# EAGLE design fpgadevbrd (EAGLE 5.07)
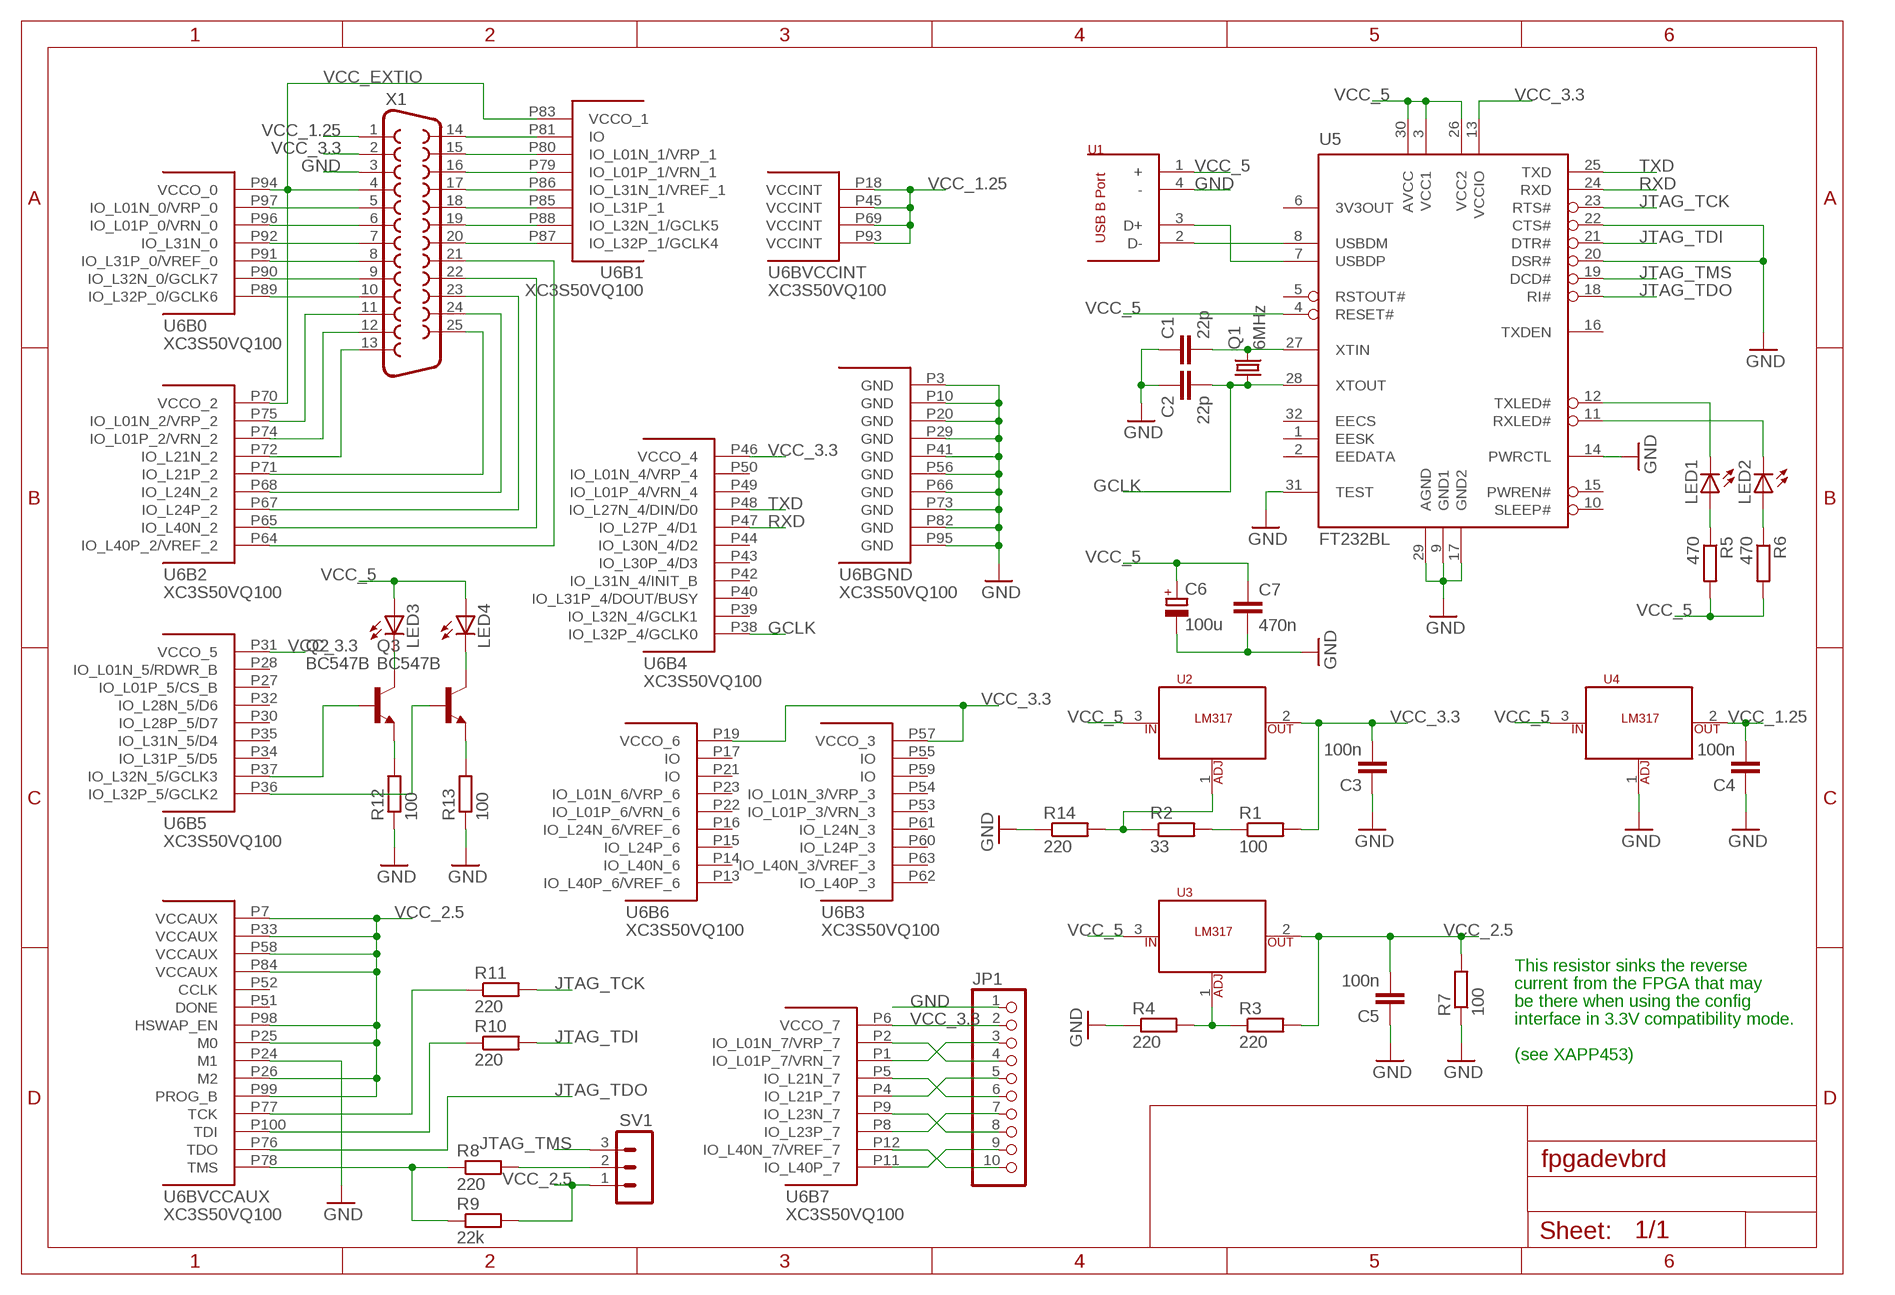
[diagram p0: schematic, sheet 1]

## Parts
C1  22p  C-EU050-025X075  [C050-025X075]
C2  22p  C-EU050-025X075  [C050-025X075]
C3  100n  C-EU050-025X075  [C050-025X075]
C4  100n  C-EU050-025X075  [C050-025X075]
C5  100n  C-EU050-025X075  [C050-025X075]
C6  100u  CPOL-EUTT5D9L  [TT5D9L]
C7  470n  C-EU050-025X075  [C050-025X075]
JP1  PINHD-1X10  [1X10]
LED1  LED5MM  [LED5MM]
LED2  LED5MM  [LED5MM]
LED3  LED5MM  [LED5MM]
LED4  LED5MM  [LED5MM]
Q1  6MHz  CRYSTALHC49U70  [HC49U70]
Q2  BC547B  [TO92]
Q3  BC547B  [TO92]
R1  100  R-EU_0204/7  [0204/7]
R2  33  R-EU_0204/7  [0204/7]
R3  220  R-EU_0204/7  [0204/7]
R4  220  R-EU_0204/7  [0204/7]
R5  470  R-EU_0204/7  [0204/7]
R6  470  R-EU_0204/7  [0204/7]
R7  100  R-EU_0204/7  [0204/7]
R8  220  R-EU_0204/7  [0204/7]
R9  22k  R-EU_0204/7  [0204/7]
R10  220  R-EU_0204/7  [0204/7]
R11  220  R-EU_0204/7  [0204/7]
R12  100  R-EU_0204/7  [0204/7]
R13  100  R-EU_0204/7  [0204/7]
R14  220  R-EU_0204/7  [0204/7]
SV1  MA03-1  [MA03-1]
U1  USB_B  [USB_B]
U2  LM317  [TO220]
U3  LM317  [TO220]
U4  LM317  [TO220]
U5  FT232BL  [LQFP32]
U6  XC3S50VQ100  [VQ100]
X1  F25D  [F25D]

## Nets
GCLK: C2.2 Q1.1 U5.28(XTOUT) U6.P38(B4:IO_L32P_4/GCLK0)
GND [pwr]: C1.1 C2.1 C3.1 C4.1 C5.1 C6.- C7.2 JP1.1 R4.1 R7.1 R12.1 R13.1 R14.1 U1.4(-) U4.1(ADJ) U5.9(GND1) U5.14(PWRCTL) U5.17(GND2) U5.20(DSR#) U5.22(CTS#) U5.29(AGND) U5.31(TEST) U6.P3(BGND:GND) U6.P10(BGND:GND) U6.P20(BGND:GND) U6.P24(BVCCAUX:M1) U6.P29(BGND:GND) U6.P41(BGND:GND) U6.P56(BGND:GND) U6.P66(BGND:GND) U6.P73(BGND:GND) U6.P82(BGND:GND) U6.P95(BGND:GND) X1.3
JTAG_TCK: R11.2 U5.23(RTS#)
JTAG_TDI: R10.2 U5.21(DTR#)
JTAG_TDO: U5.18(RI#) U6.P76(BVCCAUX:TDO)
JTAG_TMS: SV1.3 U5.19(DCD#)
N$1: R8.1 R9.1 U6.P78(BVCCAUX:TMS)
N$2: R1.1 R2.2
N$3: U1.3(D+) U5.7(USBDP)
N$4: R3.1 R4.2 U3.1(ADJ)
N$5: U1.2(D-) U5.8(USBDM)
N$6: C1.2 Q1.2 U5.27(XTIN)
N$7: R2.1 R14.2 U2.1(ADJ)
N$8: LED1.A R5.1
N$9: LED2.A R6.1
N$10: LED1.K(C) U5.12(TXLED#)
N$11: LED2.K(C) U5.11(RXLED#)
N$12: R10.1 U6.P100(BVCCAUX:TDI)
N$13: R11.1 U6.P77(BVCCAUX:TCK)
N$14: R8.2 SV1.2
N$15: U6.P97(B0:IO_L01N_0/VRP_0) X1.5
N$16: U6.P96(B0:IO_L01P_0/VRN_0) X1.6
N$17: U6.P92(B0:IO_L31N_0) X1.7
N$18: U6.P91(B0:IO_L31P_0/VREF_0) X1.8
N$19: U6.P90(B0:IO_L32N_0/GCLK7) X1.9
N$20: U6.P89(B0:IO_L32P_0/GCLK6) X1.10
N$21: U6.P81(B1:IO) X1.14
N$22: U6.P80(B1:IO_L01N_1/VRP_1) X1.15
N$23: U6.P79(B1:IO_L01P_1/VRN_1) X1.16
N$24: U6.P86(B1:IO_L31N_1/VREF_1) X1.17
N$25: U6.P85(B1:IO_L31P_1) X1.18
N$26: U6.P88(B1:IO_L32N_1/GCLK5) X1.19
N$27: U6.P87(B1:IO_L32P_1/GCLK4) X1.20
N$28: U6.P75(B2:IO_L01N_2/VRP_2) X1.11
N$29: U6.P74(B2:IO_L01P_2/VRN_2) X1.12
N$30: U6.P72(B2:IO_L21N_2) X1.13
N$31: U6.P71(B2:IO_L21P_2) X1.25
N$32: U6.P68(B2:IO_L24N_2) X1.24
N$33: U6.P67(B2:IO_L24P_2) X1.23
N$34: U6.P65(B2:IO_L40N_2) X1.22
N$35: U6.P64(B2:IO_L40P_2/VREF_2) X1.21
N$36: JP1.4 U6.P2(B7:IO_L01N_7/VRP_7)
N$37: Q2.1(E) R12.2
N$38: LED4.K(C) Q3.3(C)
N$39: LED3.K(C) Q2.3(C)
N$40: Q3.1(E) R13.2
N$41: Q2.2(B) U6.P37(B5:IO_L32N_5/GCLK3)
N$42: Q3.2(B) U6.P36(B5:IO_L32P_5/GCLK2)
N$43: JP1.3 U6.P1(B7:IO_L01P_7/VRN_7)
N$44: JP1.6 U6.P5(B7:IO_L21N_7)
N$45: JP1.5 U6.P4(B7:IO_L21P_7)
N$46: JP1.8 U6.P9(B7:IO_L23N_7)
N$47: JP1.7 U6.P8(B7:IO_L23P_7)
N$48: JP1.10 U6.P12(B7:IO_L40N_7/VREF_7)
N$49: JP1.9 U6.P11(B7:IO_L40P_7)
RXD: U5.24(RXD) U6.P47(B4:IO_L27P_4/D1)
TXD: U5.25(TXD) U6.P48(B4:IO_L27N_4/DIN/D0)
VCC_1.25 [pwr]: C4.2 U4.2(V_OUT) U6.P18(BVCCINT:VCCINT) U6.P45(BVCCINT:VCCINT) U6.P69(BVCCINT:VCCINT) U6.P93(BVCCINT:VCCINT) X1.1
VCC_2.5 [pwr]: C5.2 R3.2 R7.2 R9.2 SV1.1 U3.2(V_OUT) U6.P7(BVCCAUX:VCCAUX) U6.P25(BVCCAUX:M0) U6.P26(BVCCAUX:M2) U6.P33(BVCCAUX:VCCAUX) U6.P58(BVCCAUX:VCCAUX) U6.P84(BVCCAUX:VCCAUX) U6.P98(BVCCAUX:HSWAP_EN) U6.P99(BVCCAUX:PROG_B)
VCC_3.3 [pwr]: C3.2 JP1.2 R1.2 U2.2(V_OUT) U5.13(VCCIO) U6.P6(B7:VCCO_7) U6.P19(B6:VCCO_6) U6.P31(B5:VCCO_5) U6.P46(B4:VCCO_4) U6.P57(B3:VCCO_3) X1.2
VCC_5 [pwr]: C6.+ C7.1 LED3.A LED4.A R5.2 R6.2 U1.1(+) U2.3(V_IN) U3.3(V_IN) U4.3(V_IN) U5.3(VCC1) U5.4(RESET#) U5.26(VCC2) U5.30(AVCC)
VCC_EXTIO [pwr]: U6.P70(B2:VCCO_2) U6.P83(B1:VCCO_1) U6.P94(B0:VCCO_0) X1.4
Unconnected: U5.1(EESK) U5.2(EEDATA) U5.5(RSTOUT#) U5.6(3V3OUT) U5.10(SLEEP#) U5.15(PWREN#) U5.16(TXDEN) U5.32(EECS) U6.P13(B6:IO_L40P_6/VREF_6) U6.P14(B6:IO_L40N_6) U6.P15(B6:IO_L24P_6) U6.P16(B6:IO_L24N_6/VREF_6) U6.P17(B6:IO) U6.P21(B6:IO) U6.P22(B6:IO_L01P_6/VRN_6) U6.P23(B6:IO_L01N_6/VRP_6) U6.P27(B5:IO_L01P_5/CS_B) U6.P28(B5:IO_L01N_5/RDWR_B) U6.P30(B5:IO_L28P_5/D7) U6.P32(B5:IO_L28N_5/D6) U6.P34(B5:IO_L31P_5/D5) U6.P35(B5:IO_L31N_5/D4) U6.P39(B4:IO_L32N_4/GCLK1) U6.P40(B4:IO_L31P_4/DOUT/BUSY) U6.P42(B4:IO_L31N_4/INIT_B) U6.P43(B4:IO_L30P_4/D3) U6.P44(B4:IO_L30N_4/D2) U6.P49(B4:IO_L01P_4/VRN_4) U6.P50(B4:IO_L01N_4/VRP_4) U6.P51(BVCCAUX:DONE) U6.P52(BVCCAUX:CCLK) U6.P53(B3:IO_L01P_3/VRN_3) U6.P54(B3:IO_L01N_3/VRP_3) U6.P55(B3:IO) U6.P59(B3:IO) U6.P60(B3:IO_L24P_3) U6.P61(B3:IO_L24N_3) U6.P62(B3:IO_L40P_3) U6.P63(B3:IO_L40N_3/VREF_3)

## Notes on the sheet
- This resistor sinks the reverse
- current from the FPGA that may
- be there when using the config
- interface in 3.3V compatibility mode.
- (see XAPP453)

## Library data of the parts
C1-C5 C7 = resistor:C-EU: CAPACITOR, European symbol
C6 = resistor:CPOL-EU: POLARIZED CAPACITOR, European symbol
JP1 = pinhead:PINHD-1X10: PIN HEADER
LED1-LED4 = led:LED: LED OSRAM: - CHIPLED LG R971, LG N971, LY N971, LG Q971, LY Q971, LO R971, LY R971 LH N974, LH R974 LS Q976, LO Q976, LY Q976 LO Q996 - Hyper CHIPLED LW Q18S LB Q993, LB Q99A, LB R99A - SideLED LS A670, LO A670, LY A670, LG A670, LP A670 LB A673, LV A673, LT A673, LW A673 LH A674 LY A675 LS A676, LA A676, LO A676, LY A676, LW A676 LS A679, LY A679, LG A679 - Hyper Micro SIDELED® LS Y876, LA Y876, LO Y876, LY Y876 LT Y87S - SmartLED LW L88C, LW L88S LB L89C, LB L89S, LG L890 LS L89K, LO L89K, LY L89K LS L896, LA L896, LO L896, LY L896 - TOPLED LS T670, LO T670, LY T670, LG T670, LP T670 LSG T670, LSP T670, LSY T670, LOP T670, LYG T670 LG T671, LOG T671, LSG T671 LB T673, LV T673, LT T673, LW T673 LH T674 LS T676, LA T676, LO T676, LY T676, LB T676, LH T676, LSB T676, LW T676 LB T67C, LV T67C, LT T67C, LS T67K, LO T67K, LY T67K, LW E67C LS E67B, LA E67B, LO E67B, LY E67B, LB E67C, LV E67C, LT E67C LW T67C LS T679, LY T679, LG T679 LS T770, LO T770, LY T770, LG T770, LP T770 LB T773, LV T773, LT T773, LW T773 LH T774 LS E675, LA E675, LY E675, LS T675 LS T776, LA T776, LO T776, LY T776, LB T776 LHGB T686 LT T68C, LB T68C - Hyper Mini TOPLED® LB M676 - Mini TOPLED Santana® LG M470 LS M47K, LO M47K, LY M47K Source: http://www.osram.convergy.de LUXEON: - LUMILED® LXK2-PW12-R00, LXK2-PW12-S00, LXK2-PW14-U00, LXK2-PW14-V00 LXK2-PM12-R00, LXK2-PM12-S00, LXK2-PM14-U00 LXK2-PE12-Q00, LXK2-PE12-R00, LXK2-PE12-S00, LXK2-PE14-T00, LXK2-PE14-U00 LXK2-PB12-K00, LXK2-PB12-L00, LXK2-PB12-M00, LXK2-PB14-N00, LXK2-PB14-P00, LXK2-PB14-Q00 LXK2-PR12-L00, LXK2-PR12-M00, LXK2-PR14-Q00, LXK2-PR14-R00 LXK2-PD12-Q00, LXK2-PD12-R00, LXK2-PD12-S00 LXK2-PH12-R00, LXK2-PH12-S00 LXK2-PL12-P00, LXK2-PL12-Q00, LXK2-PL12-R00 Source: www.luxeon.com KINGBRIGHT: KA-3528ASYC Source: www.kingbright.com
Q1 = crystal:CRYSTAL: CRYSTAL
Q2 Q3 = transistor-npn:BC547*: NPN Transistor
R1-R14 = resistor:R-EU_: RESISTOR, European symbol
SV1 = con-lstb:MA03-1: PIN HEADER
U1 = library:USB_B
U2-U4 = library:LM317; TYPE: LM317
U5 = library:FT232BL: USB UART 2nd Generation USB UART (USB <-> Serial) Controller
U6 = library:XC3S50VQ100: Xilinx FPGA: XC3S50VQ100
X1 = con-subd:F25: SUB-D

## Net classes
1 pwr: width 0.762 mm

## Board
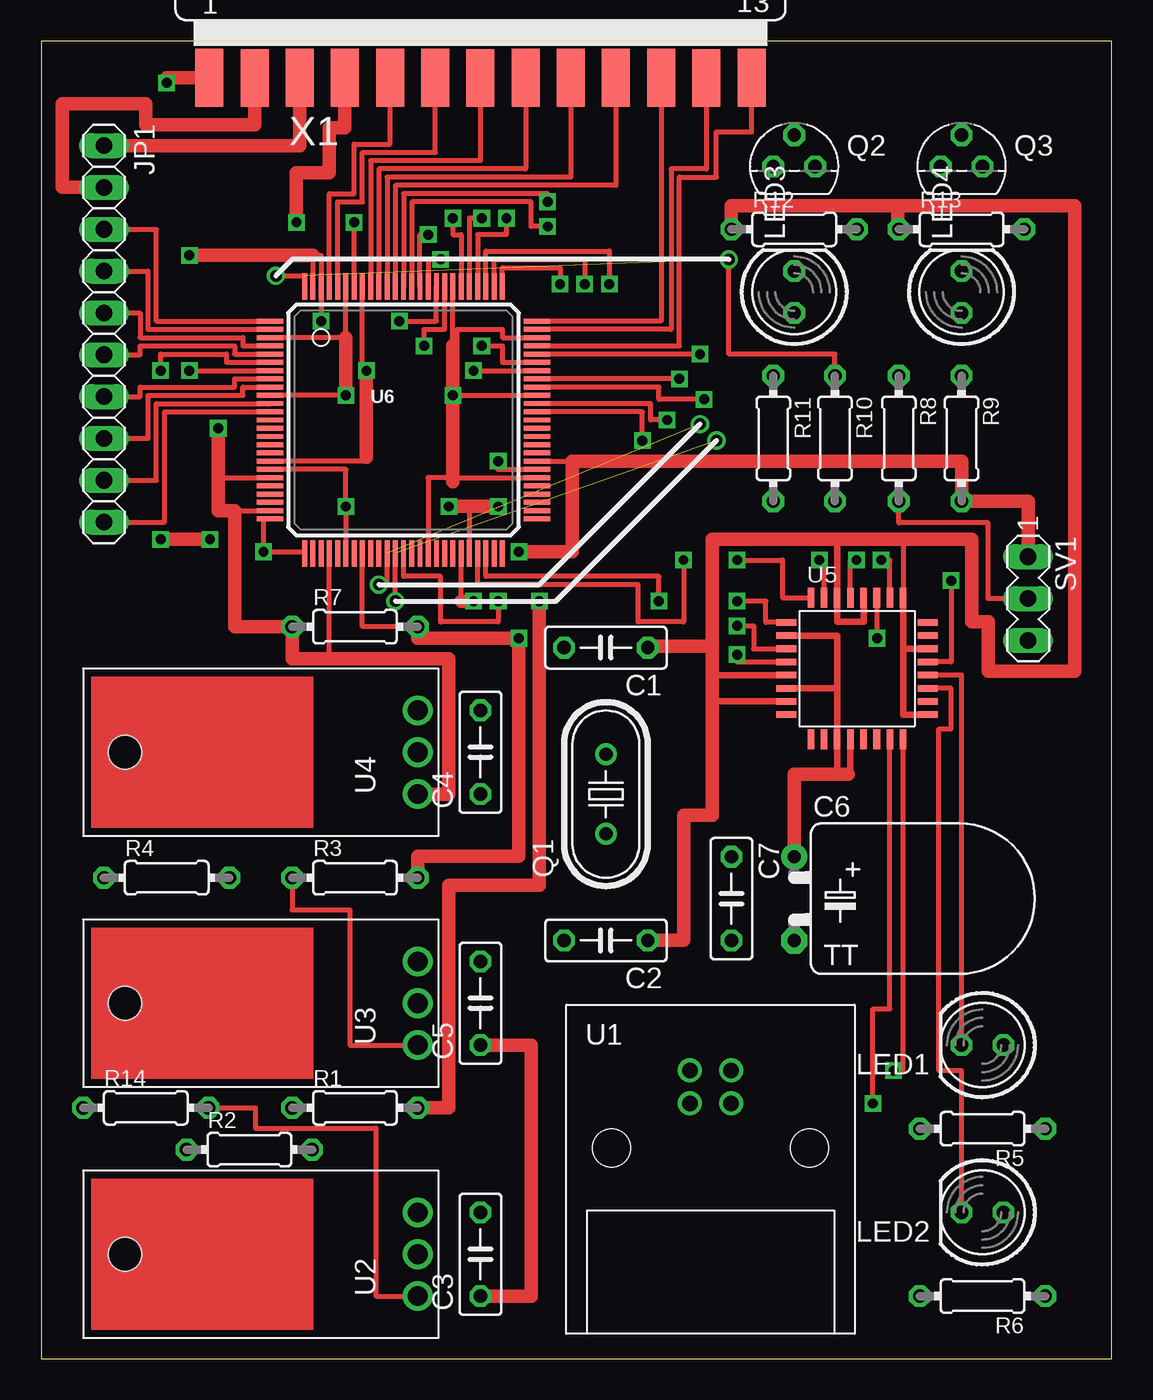
[diagram p1: board, top side]
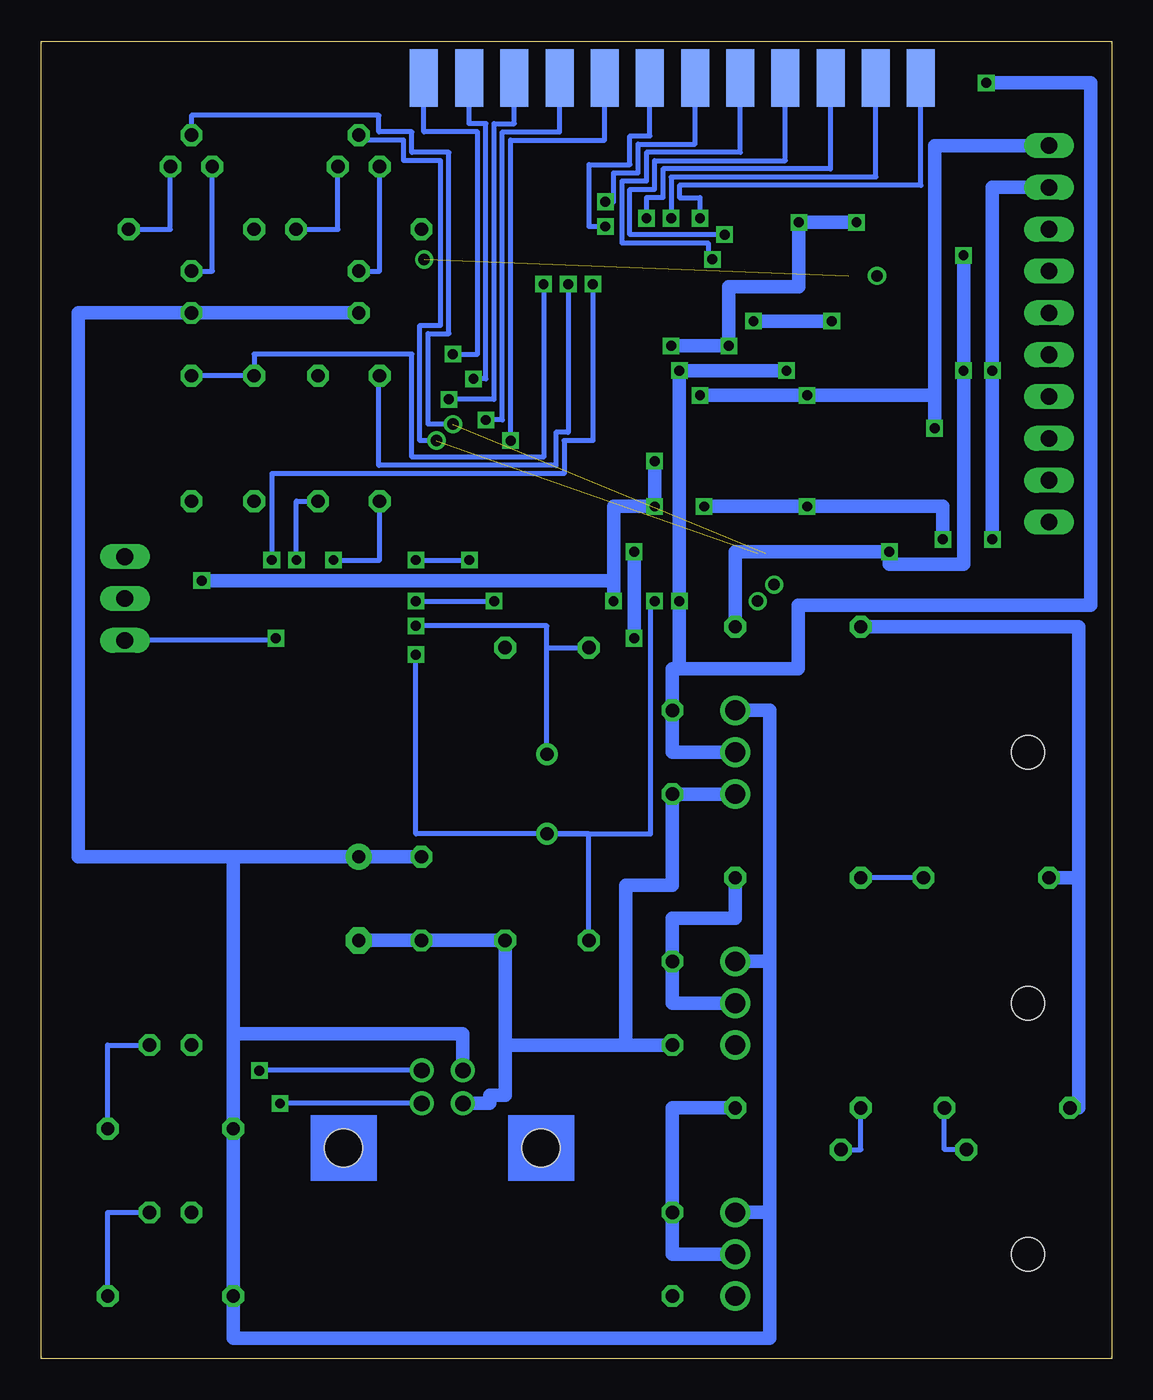
[diagram p2: board, bottom side, seen from below]

Size 65 x 80 mm. Coordinates in mm from the lower left corner, seen from the top.
Outline: 0,0 65,0 65,80 0,80 0,0
Copper layers (1*16): Top 0.035mm / dielectric 1.5mm / Bottom 0.035mm
Design rules "default *": minimum track width 10mil, minimum drill 20mil, track to track 6mil, track to pad 6mil, pad to pad 6mil, via to via 6mil, smd to smd 6mil, copper to edge 10mil, drill to drill 8mil, minimum pad ring 10mil, minimum via ring 8mil, stop-mask expansion 4mil, vias tented up to drill 0mil, thermal gap 10mil

### Footprints (pad centres in the part's own frame; a part is rotated, then mirrored left to right if it is on the bottom)
C050-025X075 = drill 0.813 octagon: 1 -2.54,0; 2 2.54,0
TT5D9L = drill 0.813 pad 1.6 round: + -2.54,0 | drill 0.813 pad 1.6 octagon: - 2.54,0
1X10 = drill 1.016 long: 1 -11.43,0; 2 -8.89,0; 3 -6.35,0; 4 -3.81,0; 5 -1.27,0; 6 1.27,0; 7 3.81,0; 8 6.35,0; 9 8.89,0; 10 11.43,0
LED5MM = drill 0.813 octagon: A -1.27,0; K 1.27,0
HC49U70 = drill 0.813 round: 1 -2.413,0; 2 2.413,0
TO92 = drill 0.813 octagon: 1 1.27,0; 2 0,1.905; 3 -1.27,0
0204/7 = drill 0.813 octagon: 1 -3.81,0; 2 3.81,0
MA03-1 = drill 1.016 long: 1 -2.54,0; 2 0,0; 3 2.54,0
USB_B = drill 0.95 round: 1 -1.25,1; 2 1.25,1; 3 1.25,-1; 4 -1.25,-1 | hole 2.3: -6,-3.71; 6,-3.71
TO220 = drill 1.2 round: 1 2.54,0; 2 0,0; 3 -2.54,0 | hole 2: 0,-17.78
LQFP32 = smd 0.4 x 1.2: 1 -2.8,-4.3; 2 -2,-4.3; 3 -1.2,-4.3; 4 -0.4,-4.3; 5 0.4,-4.3; 6 1.2,-4.3; 7 2,-4.3; 8 2.8,-4.3; 17 2.8,4.3; 18 2,4.3; 19 1.2,4.3; 20 0.4,4.3; 21 -0.4,4.3; 22 -1.2,4.3; 23 -2,4.3; 24 -2.8,4.3 | smd 1.2 x 0.4: 9 4.3,-2.8; 10 4.3,-2; 11 4.3,-1.2; 12 4.3,-0.4; 13 4.3,0.4; 14 4.3,1.2; 15 4.3,2; 16 4.3,2.8; 25 -4.3,2.8; 26 -4.3,2; 27 -4.3,1.2; 28 -4.3,0.4; 29 -4.3,-0.4; 30 -4.3,-1.2; 31 -4.3,-2; 32 -4.3,-2.8
VQ100 = smd 1.6 x 0.3: P1 -8.1,6; P2 -8.1,5.5; P3 -8.1,5; P4 -8.1,4.5; P5 -8.1,4; P6 -8.1,3.5; P7 -8.1,3; P8 -8.1,2.5; P9 -8.1,2; P10 -8.1,1.5; P11 -8.1,1; P12 -8.1,0.5; P13 -8.1,0; P14 -8.1,-0.5; P15 -8.1,-1; P16 -8.1,-1.5; P17 -8.1,-2; P18 -8.1,-2.5; P19 -8.1,-3; P20 -8.1,-3.5; P21 -8.1,-4; P22 -8.1,-4.5; P23 -8.1,-5; P24 -8.1,-5.5; P25 -8.1,-6; P51 8.1,-6; P52 8.1,-5.5; P53 8.1,-5; P54 8.1,-4.5; P55 8.1,-4; P56 8.1,-3.5; P57 8.1,-3; P58 8.1,-2.5; P59 8.1,-2; P60 8.1,-1.5; P61 8.1,-1; P62 8.1,-0.5; P63 8.1,0; P64 8.1,0.5; P65 8.1,1; P66 8.1,1.5; P67 8.1,2; P68 8.1,2.5; P69 8.1,3; P70 8.1,3.5; P71 8.1,4; P72 8.1,4.5; P73 8.1,5; P74 8.1,5.5; P75 8.1,6 | smd 0.3 x 1.6: P26 -6,-8.1; P27 -5.5,-8.1; P28 -5,-8.1; P29 -4.5,-8.1; P30 -4,-8.1; P31 -3.5,-8.1; P32 -3,-8.1; P33 -2.5,-8.1; P34 -2,-8.1; P35 -1.5,-8.1; P36 -1,-8.1; P37 -0.5,-8.1; P38 0,-8.1; P39 0.5,-8.1; P40 1,-8.1; P41 1.5,-8.1; P42 2,-8.1; P43 2.5,-8.1; P44 3,-8.1; P45 3.5,-8.1; P46 4,-8.1; P47 4.5,-8.1; P48 5,-8.1; P49 5.5,-8.1; P50 6,-8.1; P76 6,8.1; P77 5.5,8.1; P78 5,8.1; P79 4.5,8.1; P80 4,8.1; P81 3.5,8.1; P82 3,8.1; P83 2.5,8.1; P84 2,8.1; P85 1.5,8.1; P86 1,8.1; P87 0.5,8.1; P88 0,8.1; P89 -0.5,8.1; P90 -1,8.1; P91 -1.5,8.1; P92 -2,8.1; P93 -2.5,8.1; P94 -3,8.1; P95 -3.5,8.1; P96 -4,8.1; P97 -4.5,8.1; P98 -5,8.1; P99 -5.5,8.1; P100 -6,8.1
F25D = smd 1.7 x 3.5: 1 -16.459,-6.045; 2 -13.716,-6.045; 3 -10.973,-6.045; 4 -8.23,-6.045; 5 -5.486,-6.045; 6 -2.743,-6.045; 7 0,-6.045; 8 2.743,-6.045; 9 5.486,-6.045; 10 8.23,-6.045; 11 10.973,-6.045; 12 13.716,-6.045; 13 16.459,-6.045 | smd 1.7 x 3.5 bottom: 14 -15.088,-6.045; 15 -12.344,-6.045; 16 -9.601,-6.045; 17 -6.858,-6.045; 18 -4.115,-6.045; 19 -1.372,-6.045; 20 1.372,-6.045; 21 4.115,-6.045; 22 6.858,-6.045; 23 9.601,-6.045; 24 12.344,-6.045; 25 15.088,-6.045

### Placement (x,y rotation side)
C1  34.29,43.18 180 top
C2  34.29,25.4 180 top
C3  26.67,6.35 90 top
C4  26.67,36.83 90 top
C5  26.67,21.59 90 top
C6  45.72,27.94 270 top
C7  41.91,27.94 270 top
JP1  3.81,62.23 270 top
LED1  57.15,19.05 180 top
LED2  57.15,8.89 180 top
LED3  45.72,64.77 90 top
LED4  55.88,64.77 90 top
Q1  34.29,34.29 90 top
Q2  45.72,72.39 0 top
Q3  55.88,72.39 0 top
R1  19.05,15.24 0 top
R2  12.64,12.7 0 top
R3  19.05,29.21 0 top
R4  7.62,29.21 0 top
R5  57.15,13.97 180 top
R6  57.15,3.81 180 top
R7  19.05,44.45 0 top
R8  52.07,55.88 270 top
R9  55.88,55.88 270 top
R10  48.19,55.88 270 top
R11  44.45,55.88 270 top
R12  45.72,68.58 0 top
R13  55.88,68.58 0 top
R14  6.35,15.24 0 top
SV1  59.92,46.16 270 top
U1  40.64,16.51 0 top
U2  22.86,6.35 270 top
U3  22.86,21.59 270 top
U4  22.86,36.83 270 top
U5  49.53,41.91 0 top
U6  22,57 0 top
X1  26.67,83.82 0 top

### Tracks (layer width: path | path; a pad name or v marks a point on that pad's centre or on a via)
GCLK  (via drill 0.6)
  Top 0.305: U5.28 42.25,42.31 v42.25,42.75 | U6.P38 22,47.5 24.25,47.5 24.25,44.75 27.75,44.75 v27.75,46
  Bottom 0.305: v42.25,42.75 42.25,31.88 Q1.1 | v27.75,46 28,46 28,31.88 Q1.1 | Q1.1 31.75,31.88 C2.2
GND  (via drill 0.6)
  Top 0.305: 17.5,42.5 U6.P29 | 10.75,53.5 U6.P20 | 11.75,51.5 U6.P24 | U6.P82 25,61.5 25.25,61.5 25.25,62.5 28,62.5 28,62 U6.P73 | v25,58.5 U6.P66 | U6.P56 25,53.5 23.5,53.5 U6.P41 | v18.5,58.5 U6.P10 | U6.P3 18.5,62 U6.P95 | 52.33,49.75 U5.17
  Top 0.406: U5.31 40.75,39.91 40.75,40 | U5.29 40.75,41.51 40.75,41.5 | 48.25,49.75 48.33,49.75 U5.22 48.33,44.75 49.93,44.75 U5.20 | 52.25,49.75 52.33,49.75 | 52.33,43.11 52.33,39.11 U5.9 | 52.33,43.11 U5.14 | U5.17 52.33,43.11
  Top 0.813: C5.1 29.75,19.05 29.75,3.81 C3.1 | U4.1 24.75,34.29 24.75,42.5 17.5,42.5 15.24,42.5 R7.1 11.75,44.45 11.75,51.5 10.75,51.5 10.75,53.5 v10.75,56.5 | 48.25,49.75 40.75,49.75 40.75,43.25 | 40.75,43.25 40.75,41.5 40.75,40 40.75,33 39,33 39,25.4 C2.1 | 48.33,49.75 52.25,49.75 | JP1.1 15.7,73.66 X1.3 | 25,61.5 v25,58.5 25,53.5 25,53.25 | v18.5,58.5 18.5,62 | C1.1 36.83,43.25 40.75,43.25 | R13.1 52,68.58 52,70 | 52,70 41.91,70 R12.1 | 52.33,49.75 56.5,49.75 56.5,44.75 57.5,44.75 57.5,41.75 62.75,41.75 62.75,70 52,70
  Bottom 0.813: C7.2 39.39,25.4 | C7.2 C6.- | C7.2 C2.1 36.83,19.05 | 29.5,19.05 C5.1 | 29.5,19.05 36.83,19.05 | U4.1 C4.1 26.67,28.75 29.5,28.75 29.5,19.05 | 2,29.21 2,44.45 R7.1 | 2,29.21 R4.1 | 10.75,58.5 v18.5,58.5 v25,58.5 | 10.75,58.5 10.75,73.66 JP1.1 | v10.75,56.5 10.75,58.5 | 2,29.21 2,15.24 R14.1 | 36.83,19.05 36.83,16 37.75,16 37.75,15.51 U1.4
JTAG_TCK  (via drill 0.6)
  Top 0.305: U5.23 47.53,48.5 v47.25,48.5
  Bottom 0.305: v47.25,48.5 44.45,48.5 R11.2
JTAG_TDI  (via drill 0.6)
  Top 0.305: U5.21 49.13,48.5 v49.5,48.5
  Bottom 0.305: v49.5,48.5 49.5,52.07 R10.2
JTAG_TDO  (via drill 0.6)
  Top 0.305: U5.18 51.53,48.5 v51,48.5 | U6.P76 28,66.25 31.5,66.25 v31.5,65.25
  Bottom 0.305: v31.5,65.25 31.5,55.75 33.25,55.75 33.25,53.75 51,53.75 v51,48.5
JTAG_TMS  (via drill 0.6)
  Top 0.305: U5.19 50.73,43.75 v50.75,43.75
  Bottom 0.305: v50.75,43.75 50.75,43.62 SV1.3
N$1  (via drill 0.6)
  Top 0.305: U6.P78 27,67.25 34.5,67.25 v34.5,65.25
  Bottom 0.305: R9.1 R8.1 52.07,61 42.5,61 42.5,54.75 34.5,54.75 v34.5,65.25
N$2
  Bottom 0.305: R1.1 15.24,12.7 R2.2
N$3  (via drill 0.6)
  Top 0.305: v50.5,15.5 50.5,21.25 51.53,21.25 U5.7
  Bottom 0.305: U1.3 v50.5,15.51 v50.5,15.5
N$4
  Top 0.305: R3.1 15.24,27.25 18.75,27.25 18.75,19.05 U3.1
  Bottom 0.305: R4.2 R3.1
N$5  (via drill 0.6)
  Top 0.305: v51.75,17.5 52.33,17.5 U5.8
  Bottom 0.305: U1.2 v51.75,17.51 v51.75,17.5
N$6  (via drill 0.6)
  Top 0.305: U5.27 43.25,43.11 43.25,44.5 v42.25,44.5
  Bottom 0.305: v42.25,44.5 34.29,44.5 34.29,43.25 34.29,43.18 | Q1.2 34.29,43.18 | 34.29,43.18 C1.2
N$7
  Top 0.305: U2.1 20.32,3.81 20.32,14 13,14 13,15.24 R14.2
  Bottom 0.305: R14.2 10.16,12.7 R2.1
N$8
  Bottom 0.305: R5.1 60.96,19.05 LED1.A
N$9
  Bottom 0.305: R6.1 60.96,8.89 LED2.A
N$10
  Top 0.305: LED1.K 55.88,41.51 U5.12
N$11
  Top 0.305: LED2.K 55.88,17.5 54.5,17.5 54.5,38.25 55.25,38.25 55.25,40.71 U5.11
N$12  (via drill 0.7)  (1 unrouted)
  Top 0.305: U6.P100 16,65.75 v14.25,65.75 | R10.1 48.19,61 41.75,61 v41.75,66.75
N$13  (via drill 0.6)
  Top 0.305: U6.P77 27.5,66.75 33,66.75 v33,65.25
  Bottom 0.305: v33,65.25 33,56.25 33.75,56.25 33.75,54.25 44.5,54.25 44.5,59.69 R11.1
N$14
  Top 0.305: SV1.2 57.5,46.16 57.5,50.75 52.07,50.75 R8.2
N$15
  Top 0.305: X1.5 21.18,73.75 19,73.75 19,70.75 17.5,70.75 U6.P97
N$16
  Top 0.305: X1.6 23.93,73.25 19.5,73.25 19.5,70.25 18,70.25 U6.P96
N$17
  Top 0.305: X1.7 26.67,72.75 20,72.75 U6.P92
N$18
  Top 0.305: X1.8 29.41,72.25 20.5,72.25 U6.P91
N$19
  Top 0.305: X1.9 32.16,71.75 21,71.75 U6.P90
N$20
  Top 0.305: X1.10 34.9,71.25 21.5,71.25 U6.P89
N$21  (via drill 0.6)
  Top 0.305: v25,69.25 25,68.25 25.5,68.25 U6.P81
  Bottom 0.305: X1.14 11.58,71.25 26.25,71.25 26.25,70.5 25,70.5 v25,69.25
N$22  (via drill 0.6)
  Top 0.305: v26.75,69.25 26,69.25 U6.P80
  Bottom 0.305: X1.15 14.33,71.75 26.75,71.75 v26.75,69.25
N$23  (via drill 0.6)
  Top 0.305: v28.25,69.25 28.25,68.25 26.5,68.25 U6.P79
  Bottom 0.305: X1.16 17.07,72.25 27.25,72.25 27.25,70.5 28.25,70.5 v28.25,69.25
N$24  (via drill 0.6)
  Top 0.305: U6.P86 23,68.25 v23.5,68.25
  Bottom 0.305: X1.17 19.81,72.75 27.75,72.75 27.75,71 29.25,71 29.25,68.25 v23.5,68.25
N$25  (via drill 0.6)
  Top 0.305: v24.25,66.75 23.5,66.75 U6.P85
  Bottom 0.305: X1.18 22.55,73.25 28.25,73.25 28.25,71.5 29.75,71.5 29.75,67.75 24.5,67.75 24.5,66.75 v24.25,66.75
N$26  (via drill 0.6)
  Top 0.305: v30.75,70.25 30.75,70.75 22,70.75 U6.P88
  Bottom 0.305: X1.19 25.3,73.75 28.75,73.75 28.75,72 30.25,72 30.25,70.25 v30.75,70.25
N$27  (via drill 0.6)
  Top 0.305: v30.75,68.75 29.75,68.75 29.75,70.25 22.5,70.25 U6.P87
  Bottom 0.305: X1.20 28.04,74.25 29.25,74.25 29.25,72.5 31.75,72.5 31.75,68.75 v30.75,68.75
N$28
  Top 0.305: X1.11 37.64,63 U6.P75
N$29
  Top 0.305: X1.12 40.39,72.25 38.25,72.25 38.25,62.5 U6.P74
N$30
  Top 0.305: U6.P72 38.75,61.5 38.75,71.75 41,71.75 41,74.5 43.13,74.5 X1.13
N$31  (via drill 0.6)
  Top 0.305: v40,61 U6.P71
  Bottom 0.305: X1.25 41.76,74.5 38.5,74.5 38.5,61 v40,61
N$32  (via drill 0.6)
  Top 0.305: v38.75,59.5 U6.P68
  Bottom 0.305: X1.24 39.01,75 38,75 38,59.5 v38.75,59.5
N$33  (via drill 0.6)
  Top 0.305: v40.25,58.25 37.5,58.25 37.5,59 U6.P67
  Bottom 0.305: X1.23 36.27,75 37.5,75 37.5,58.25 v40.25,58.25
N$34  (via drill 0.6)
  Top 0.305: v38,57 37,57 37,58 U6.P65
  Bottom 0.305: X1.22 33.53,74.5 37,74.5 37,57 v38,57
N$35  (via drill 0.6)
  Top 0.305: v36.5,55.75 36.5,57.5 U6.P64
  Bottom 0.305: X1.21 30.79,74 36.5,74 v36.5,55.75
N$36
  Top 0.305: U6.P2 6.5,62.5 6.5,66.04 JP1.4
N$37
  Bottom 0.305: R12.2 46.99,68.58 Q2.1
N$38
  Bottom 0.305: LED4.K 54.61,66.04 Q3.3
N$39
  Bottom 0.305: LED3.K 44.45,66.04 Q2.3
N$40
  Bottom 0.305: R13.2 57.15,68.58 Q3.1
N$41  (via drill 0.7)  (1 unrouted)
  Top 0.305: v21.5,46 U6.P37
  Bottom 0.305: Q2.2 45.72,74 43,74 43,72.75 40.75,72.75 40.75,62.75 42,62.75 42,55.75 v41,55.75
N$42  (via drill 0.7)  (1 unrouted)
  Top 0.305: U6.P36 21,47 v20.5,47
  Bottom 0.305: Q3.2 55.88,75.5 44.5,75.5 44.5,74.5 42.5,74.5 42.5,73.25 40.25,73.25 40.25,62.25 41.5,62.25 41.5,56.75 v40,56.75
N$43
  Top 0.305: U6.P1 7,63 7,68.58 JP1.3
N$44
  Top 0.305: JP1.6 6,60.96 6,61.5 11.75,61.5 11.75,61 U6.P5
N$45
  Top 0.305: JP1.5 6,63.5 6,62 12.25,62 12.25,61.5 U6.P4
N$46
  Top 0.305: JP1.8 6.5,55.88 6.5,58.5 12.25,58.5 12.25,59 U6.P9
N$47
  Top 0.305: JP1.7 6,58.42 6,59 11.75,59 11.75,59.5 U6.P8
N$48
  Top 0.305: U6.P12 7.5,57.5 7.5,50.8 JP1.10
N$49
  Top 0.305: U6.P11 7,58 7,53.34 JP1.9
RXD  (via drill 0.6)
  Top 0.305: U5.24 45,46.21 45,48.5 v42.25,48.5 | v39,48.5 39,44.75 36.25,44.75 36.25,47 26.5,47 U6.P47
  Bottom 0.305: v42.25,48.5 v39,48.5
TXD  (via drill 0.6)
  Top 0.305: U5.25 44,44.71 44,46 v42.25,46 | v37.5,46 37.5,47.5 27,47.5 U6.P48
  Bottom 0.305: v42.25,46 v37.5,46
VCC_1.25  (via drill 0.6)
  Top 0.305: v26.25,60 U6.P69 | U6.P93 19.5,60 v19.75,60 | U6.P18 19.75,54.5 19.75,54.75 | 25.5,46 U6.P45
  Top 0.813: X1.1 7.62,77.78 v7.62,77.47 | v19.75,60 19.75,54.75 | v26.25,46 25.5,46
  Bottom 0.813: U4.2 26.67,36.83 C4.2 | v7.62,77.47 1.27,77.47 1.27,45.74 19.05,45.74 19.05,41.91 26,41.91 26.25,41.91 | 26.25,41.91 26.67,41.91 C4.2 | C4.2 26.75,39.37 | v19.75,60 v26.25,60 v26.25,46 26.25,41.91
VCC_2.5  (via drill 0.6)
  Top 0.305: R7.2 19.5,44.45 U6.P33 | U6.P25 13.5,51 v13.5,49 16,49 U6.P26 | U6.P99 16.5,67 17,67 U6.P98 v17,63 | v9,60 U6.P7 | U6.P84 24,63 v21.75,63 | U6.P58 32.25,54.5
  Top 0.813: v9,67 16.5,67 | SV1.1 59.92,52.07 R9.2 55.88,54.5 32.25,54.5 32.25,49 v29,49 | R3.2 22.86,30.5 29,30.5 v29,43.75 22.86,43.75 R7.2
  Bottom 0.813: U3.2 26.67,21.59 C5.2 26.67,26.75 22.86,26.75 R3.2 | R7.2 22.86,49 v13.5,49 13.5,48.25 9,48.25 v9,60 v9,67 | v17,63 v21.75,63 | v29,43.75 v29,49
VCC_3.3  (via drill 0.6)
  Top 0.305: U6.P6 11.25,60.5 11.25,61 7.25,61 v7.25,60 | 26,51.75 U6.P46 | U6.P57 27.75,54 v27.75,54.5 | U6.P31 v18.5,51.75 18.5,54 U6.P19 | U5.13 55.25,42.31 v55.25,47.25
  Top 0.813: v30.25,46 30.25,28.75 24.75,28.75 24.75,15.24 R1.2 | JP1.2 1.27,71.12 1.27,76.2 6.35,76.2 6.35,74.93 12.95,74.93 X1.2 | v27.75,51.75 26,51.75 v24.75,51.75 | v10.25,49.75 v7.25,49.75
  Bottom 0.813: U2.2 26.67,6.35 C3.2 26.67,15.24 R1.2 | JP1.2 7.25,71.12 v7.25,60 v7.25,49.75 | 30.25,47.25 30.25,51.75 v27.75,51.75 v27.75,54.5 | v24.75,51.75 v18.5,51.75 10.25,51.75 v10.25,49.75 | 30.25,47.25 v55.25,47.25 | v30.25,46 30.25,47.25
VCC_5
  Top 0.406: 49,35.5 49.13,35.5 U5.4 | U5.3 48.33,35.5 48.5,35.5 | U5.3 48.33,40.71 U5.30 | U5.26 48.33,43.91 U5.3
  Top 0.813: C6.+ 45.72,35.5 48.5,35.5 49,35.5
  Bottom 0.813: 20.75,8.89 U2.3 | 20.75,8.89 20.75,24.13 | 20.75,24.13 U3.3 | 20.75,24.13 20.75,39.37 U4.3 | 53.34,30.48 C6.+ C7.1 | R5.2 53.34,30.48 | LED4.A LED3.A 62.75,63.5 62.75,30.48 53.34,30.48 | R5.2 53.34,19.75 39.39,19.75 U1.1 | 20.75,8.89 20.75,1.25 53.34,1.25 R6.2 R5.2
VCC_EXTIO  (via drill 0.6)
  Top 0.305: U6.P94 v19,69 | U6.P83 24.5,62.5 23.25,62.5 v23.25,61.5 | U6.P70 28,60.5 28,61.5 v26.75,61.5
  Top 0.813: X1.4 18.44,74.75 17.5,74.75 17.5,72 15.5,72 v15.5,69
  Bottom 0.813: v15.5,69 v19,69 U6.P94 23.25,65.1 v23.25,61.5 v26.75,61.5